# Altium schematic sheet waffling80-NMB-USB.SchDoc: =ProjectTitle
size A4; Address1: github.com/4pplet/waffling80; Address2: Licence: CERN-OHL-S; SheetNumber: 3; SheetTotal: 3
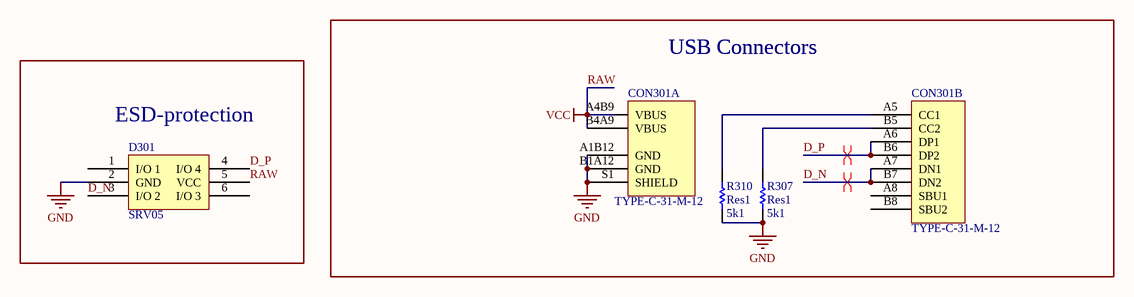
[diagram p0: waffling80-NMB-USB.SchDoc]

## Parts
CON301  TYPE-C-31-M-12  [TYPE-C-31-M-12]  (parts A,B of 2)
D301  SRV05  [SOT-23-6]
R307  Res1  value 5k1  [R0603[1608]]
R310  Res1  value 5k1  [R0603[1608]]

## Blocks framed on the sheet
ESD-protection: D301

## Nets
GND: CON301.A1B12(GND) CON301.B1A12(GND) CON301.S1(SHIELD) D301.2(GND) R307.2 R310.2
RAW: CON301.A4B9(VBUS) CON301.B4A9(VBUS) D301.5(VCC)  [also labelled VCC]
D_N: CON301.A7(DN1) CON301.B7(DN2) D301.3(I/O_2)
D_P: CON301.A6(DP1) CON301.B6(DP2) D301.4(I/O_4)
NetCON301_A5: CON301.A5(CC1) R310.1
NetCON301_B5: CON301.B5(CC2) R307.1

Not connected (* = marked no-connect by the designer): CON301 A8(SBU1) B8(SBU2); D301 1(I/O_1) 6(I/O_3)

## Layout directives
differential pair: D_N, D_P

## Notes on the sheet
- USB Connectors
- Title
- Size:
- Date:
- A4
- Number:
- Time:
- Revision:
- Sheet
- of
- File:

## Library data of the parts
CON301 = TYPE-C-31-M-12: MFG: Korean Hroparts Elec; MFGPN: TYPE-C-31-M-12; LCSC Part #: C165948; LCSC MFG: Korean Hroparts Elec; MRF.Part: TYPE-C-31-M-12
D301 = SRV05: MRF.Part: SRV05-4-P-T7; LCSC MFG: ProTek Devices; LCSC Part #: C85364
R307 R310 = Res1: Resistor; MRF.Part: 0603WAF5101T5E; MFG: Panasonic Electronic Components; MFGPN: ERJ-3EKF5101V; LCSC MFG: Uniroyal Elec; Version: 0603 imperial; LCSC Part #: C23186